# EAGLE design sensor (EAGLE 4.16)
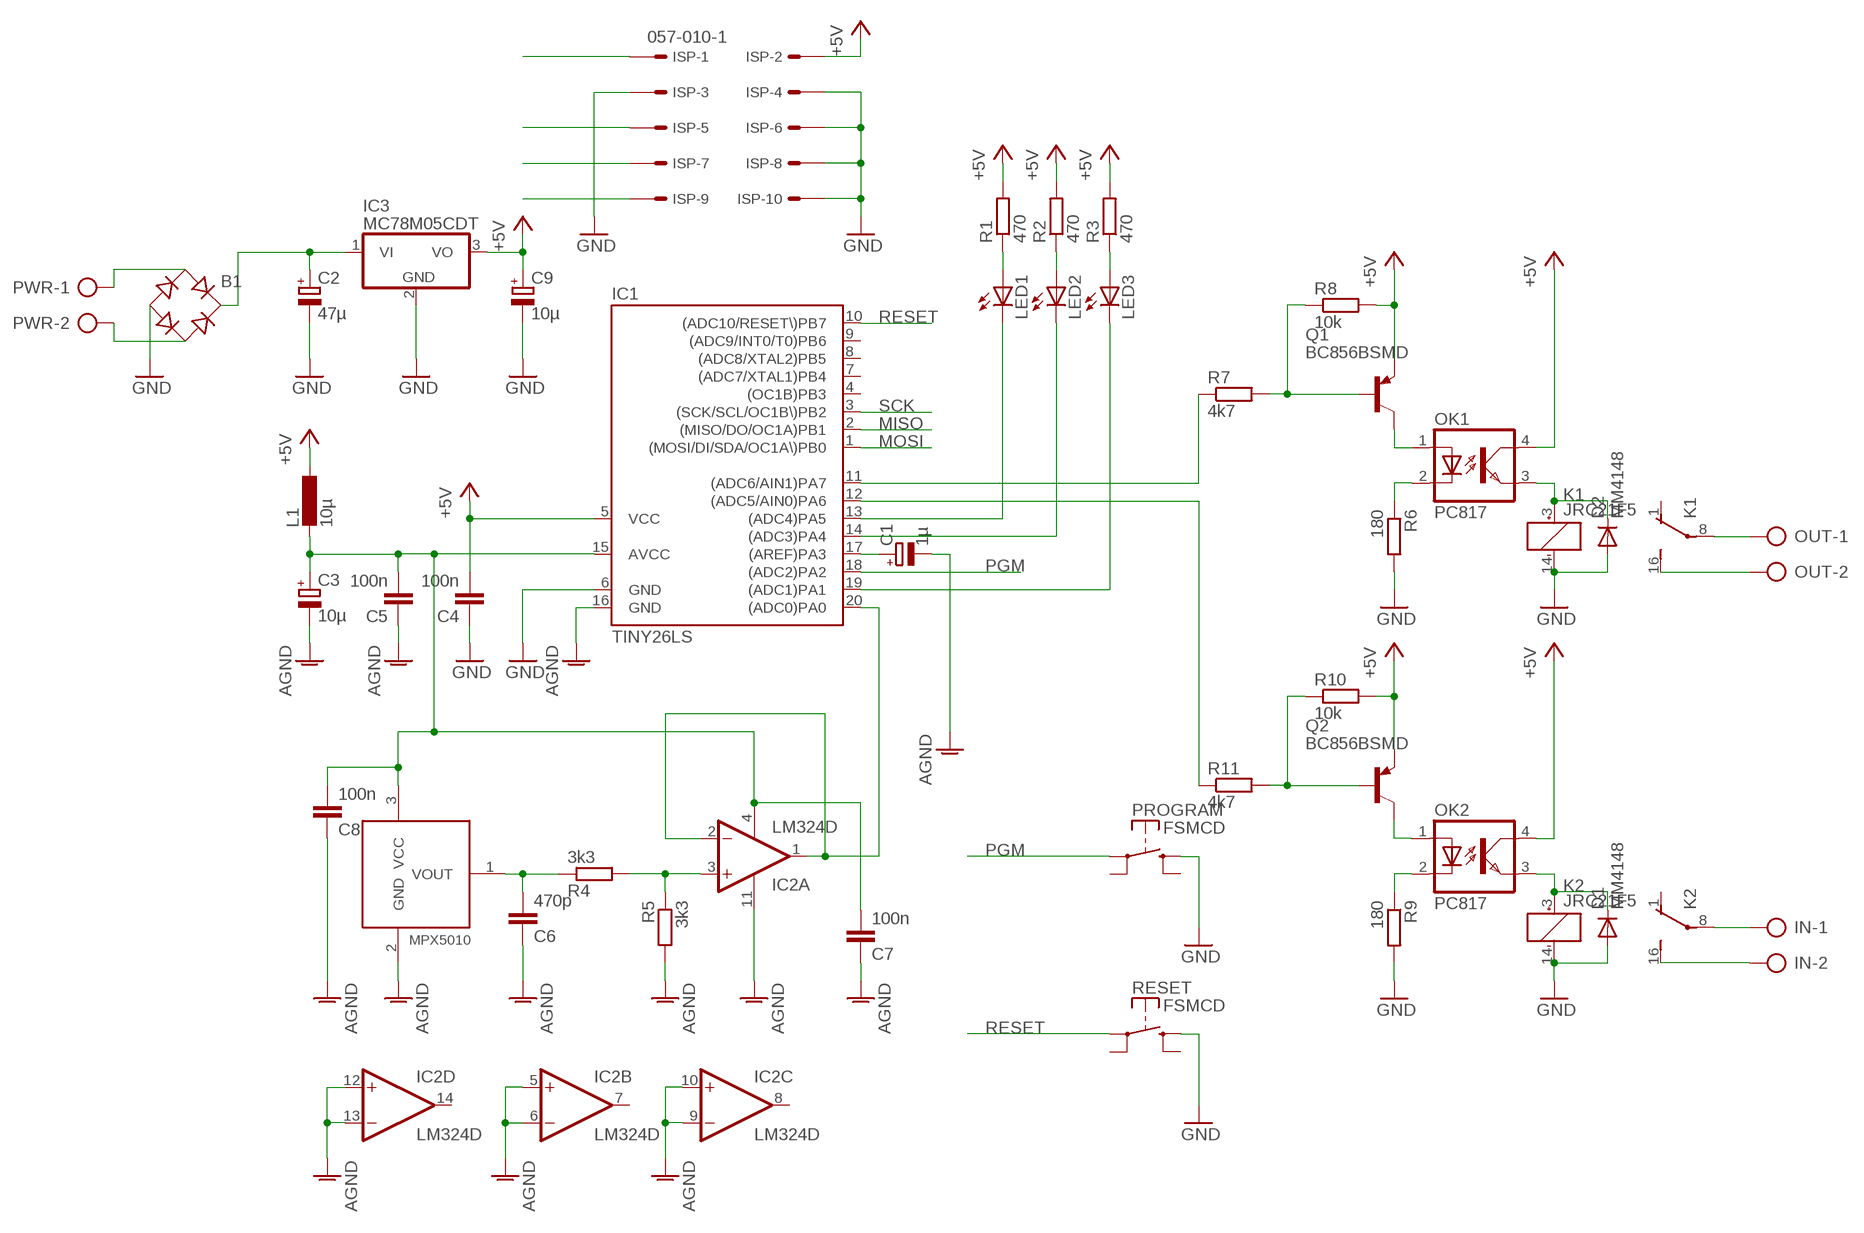
[diagram p0: schematic, sheet 1]

## Parts
B1  B-DIL  [SO04]
C1  1µ  CPOL-EUE2-5  [E2-5]
C2  47µ  CPOL-EUE3.5-8  [E3,5-8]
C3  10µ  CPOL-EUSMCC  [SMC_C]
C4  100n  C-EUC0805K  [C0805K]
C5  100n  C-EUC0805K  [C0805K]
C6  470p  C-EUC0805K  [C0805K]
C7  100n  C-EUC0805K  [C0805K]
C8  100n  C-EUC0805K  [C0805K]
C9  10µ  CPOL-EUE2-5  [E2-5]
D1  MM4148  DIODE-MINIMELF  [MINIMELF]
D2  MM4148  DIODE-MINIMELF  [MINIMELF]
IC1  TINY26LS  [SO20L]
IC2  LM324D  [SO14]
IC3  MC78M05CDT  78  [DPACK]
IN  AK500/2  [AK500/2]
ISP  057-010-1  [057-010-1]
K1  JRC21F5  [JRC21F]
K2  JRC21F5  [JRC21F]
L1  10µ  L-EU0204/7  [0204/7]
LED1  LED3MM  [LED3MM]
LED2  LED3MM  [LED3MM]
LED3  LED3MM  [LED3MM]
OK1  PC817  [DIL04]
OK2  PC817  [DIL04]
OUT  AK500/2  [AK500/2]
PROGRAM  FSMCD  [FSMCD]
PWR  AK500/2  [AK500/2]
Q1  BC856BSMD  [SOT23-BEC]
Q2  BC856BSMD  [SOT23-BEC]
R1  470  R-EU_R0805  [R0805]
R2  470  R-EU_R0805  [R0805]
R3  470  R-EU_R0805  [R0805]
R4  3k3  R-EU_R0805  [R0805]
R5  3k3  R-EU_R0805  [R0805]
R6  180  R-EU_R0805  [R0805]
R7  4k7  R-EU_R0805  [R0805]
R8  10k  R-EU_R0805  [R0805]
R9  180  R-EU_R0805  [R0805]
R10  10k  R-EU_R0805  [R0805]
R11  4k7  R-EU_R0805  [R0805]
RESET  FSMCD  [FSMCD]
U$2  MPX5010DP  [MPX5010DP]

## Nets
+5V: C4.2 C9.+ IC1.5(VCC) IC3.3(VO) ISP.2 L1.1 OK1.4(COL) OK2.4(COL) Q1.E Q2.E R1.2 R2.2 R3.2 R8.2 R10.2
AGND: C1.- C3.- C5.1 C6.1 C7.1 C8.1 IC1.16(GND) IC2.5(B:+IN) IC2.6(B:-IN) IC2.9(C:-IN) IC2.10(C:+IN) IC2.11(P:V-) IC2.12(D:+IN) IC2.13(D:-IN) R5.2 U$2.2(GND)
AVCC: C3.+ C5.2 C7.2 C8.2 IC1.15(AVCC) IC2.4(P:V+) L1.2 U$2.3(VCC)
GND: B1.2(-) C2.- C4.1 C9.- D1.A D2.A IC1.6(GND) IC3.2(GND) ISP.3 ISP.4 ISP.6 ISP.8 ISP.10 K1.14(-1:-) K2.14(-1:-) PROGRAM.P$3(S) R6.2 R9.2 RESET.P$3(S)
MISO: IC1.2((MISO/DO/OC1A)PB1) ISP.9
MOSI: IC1.1((MOSI/DI/SDA/OC1A\)PB0) ISP.1
N$1: C1.+ IC1.17((AREF)PA3)
N$2: IC2.3(A:+IN) R4.2 R5.1
N$3: B1.1(+) C2.+ IC3.1(VI)
N$4: LED1.A R1.1
N$5: LED2.A R2.1
N$6: LED3.A R3.1
N$7: IC1.19((ADC1)PA1) LED3.K(C)
N$8: IC1.13((ADC4)PA5) LED1.K(C)
N$9: IC1.14((ADC3)PA4) LED2.K(C)
N$10: IC1.20((ADC0)PA0) IC2.1(A:OUT) IC2.2(A:-IN)
N$11: OK1.1(A) Q1.C
N$12: OK1.2(C) R6.1
N$13: D2.C K1.3(-1:+) OK1.3(EMIT)
N$14: K1.8(-2:P) OUT.1
N$15: K1.16(-2:S) OUT.2
N$16: Q1.B R7.2 R8.1
N$17: D1.C K2.3(-1:+) OK2.3(EMIT)
N$18: IN.1 K2.8(-2:P)
N$19: IN.2 K2.16(-2:S)
N$20: OK2.1(A) Q2.C
N$21: OK2.2(C) R9.1
N$22: C6.2 R4.1 U$2.1(VOUT)
N$23: Q2.B R10.1 R11.2
N$24: IC1.11((ADC6/AIN1)PA7) R7.1
N$26: IC1.12((ADC5/AIN0)PA6) R11.1
N$27: B1.3(AC1) PWR.1
N$28: B1.4(AC2) PWR.2
PGM: IC1.18((ADC2)PA2) PROGRAM.P$1(P)
RESET: IC1.10((ADC10/RESET\)PB7) ISP.5 RESET.P$1(P)
SCK: IC1.3((SCK/SCL/OC1B\)PB2) ISP.7
Unconnected: IC1.4((OC1B)PB3) IC1.7((ADC7/XTAL1)PB4) IC1.8((ADC8/XTAL2)PB5) IC1.9((ADC9/INT0/T0)PB6) IC2.7(B:OUT) IC2.8(C:OUT) IC2.14(D:OUT) K1.1(-2:O) K2.1(-2:O) PROGRAM.P$2(P) PROGRAM.P$4(S) RESET.P$2(P) RESET.P$4(S) U$2.4 U$2.5 U$2.6

## Library data of the parts
B1 = mpx5010dp:B-DIL: RECTIFIER
C1-C3 C9 = rcl:CPOL-EU: POLARIZED CAPACITOR, European symbol
C4-C8 = rcl:C-EU: CAPACITOR, European symbol
D1 D2 = diode:DIODE-: DIODE
IC1 = mpx5010dp:TINY26*: 8-bit AVR Microcontroller with 2K Bytes Flash Source: http://www.atmel.com .. doc1477.pdf
IC2 = linear:LM324: OP AMP
IC3 = mpx5010dp:78*: Positive VOLTAGE REGULATOR Source: http://cache.national.com/ds/LM/LM78L05.pdf http://www.fairchildsemi.com/ds/LM/LM7805.pdf
IN OUT PWR = mpx5010dp:AK500/2: CONNECTOR
ISP = con-panduit:057-010-: CONNECTOR 10-pin series 057 contact pc board low profile headers
K1 K2 = mpx5010dp:JRC21F: HIGHLY RELIABLE MINIATURE DIP RELAYS NAiS Source: www.mew-europe.com/ac/download/ datasheet/relay/dr_en.pdf
L1 = rcl:L-EU: INDUCTOR, European symbol
LED1-LED3 = led:LED: LED OSRAM: - CHIPLED LG R971, LG N971, LY N971, LG Q971, LY Q971, LO R971, LY R971 LH N974, LH R974 LS Q976, LO Q976, LY Q976 LO Q996 - Hyper CHIPLED LW Q18S LB Q993, LB Q99A, LB R99A - SideLED LS A670, LO A670, LY A670, LG A670, LP A670 LB A673, LV A673, LT A673, LW A673 LH A674 LY A675 LS A676, LA A676, LO A676, LY A676, LW A676 LS A679, LY A679, LG A679 - Hyper Micro SIDELED® LS Y876, LA Y876, LO Y876, LY Y876 LT Y87S - SmartLED LW L88C, LW L88S LB L89C, LB L89S, LG L890 LS L89K, LO L89K, LY L89K LS L896, LA L896, LO L896, LY L896 - TOPLED LS T670, LO T670, LY T670, LG T670, LP T670 LSG T670, LSP T670, LSY T670, LOP T670, LYG T670 LG T671, LOG T671, LSG T671 LB T673, LV T673, LT T673, LW T673 LH T674 LS T676, LA T676, LO T676, LY T676, LB T676, LH T676, LSB T676, LW T676 LB T67C, LV T67C, LT T67C, LS T67K, LO T67K, LY T67K, LW E67C LS E67B, LA E67B, LO E67B, LY E67B, LB E67C, LV E67C, LT E67C LW T67C LS T679, LY T679, LG T679 LS T770, LO T770, LY T770, LG T770, LP T770 LB T773, LV T773, LT T773, LW T773 LH T774 LS E675, LA E675, LY E675, LS T675 LS T776, LA T776, LO T776, LY T776, LB T776 LHGB T686 LT T68C, LB T68C - Hyper Mini TOPLED® LB M676 - Mini TOPLED Santana® LG M470 LS M47K, LO M47K, LY M47K Source: http://www.osram.convergy.de/
OK1 OK2 = optocoupler:PC817: SHARP OPTO COUPLER
PROGRAM RESET = mpx5010dp:FSMCD: TYCO SWITCH
Q1 Q2 = transistor-pnp:BC856*: PNP Transistror
R1-R11 = rcl:R-EU_: RESISTOR, European symbol
U$2 = mpx5010dp:MPX5010DP

## Board
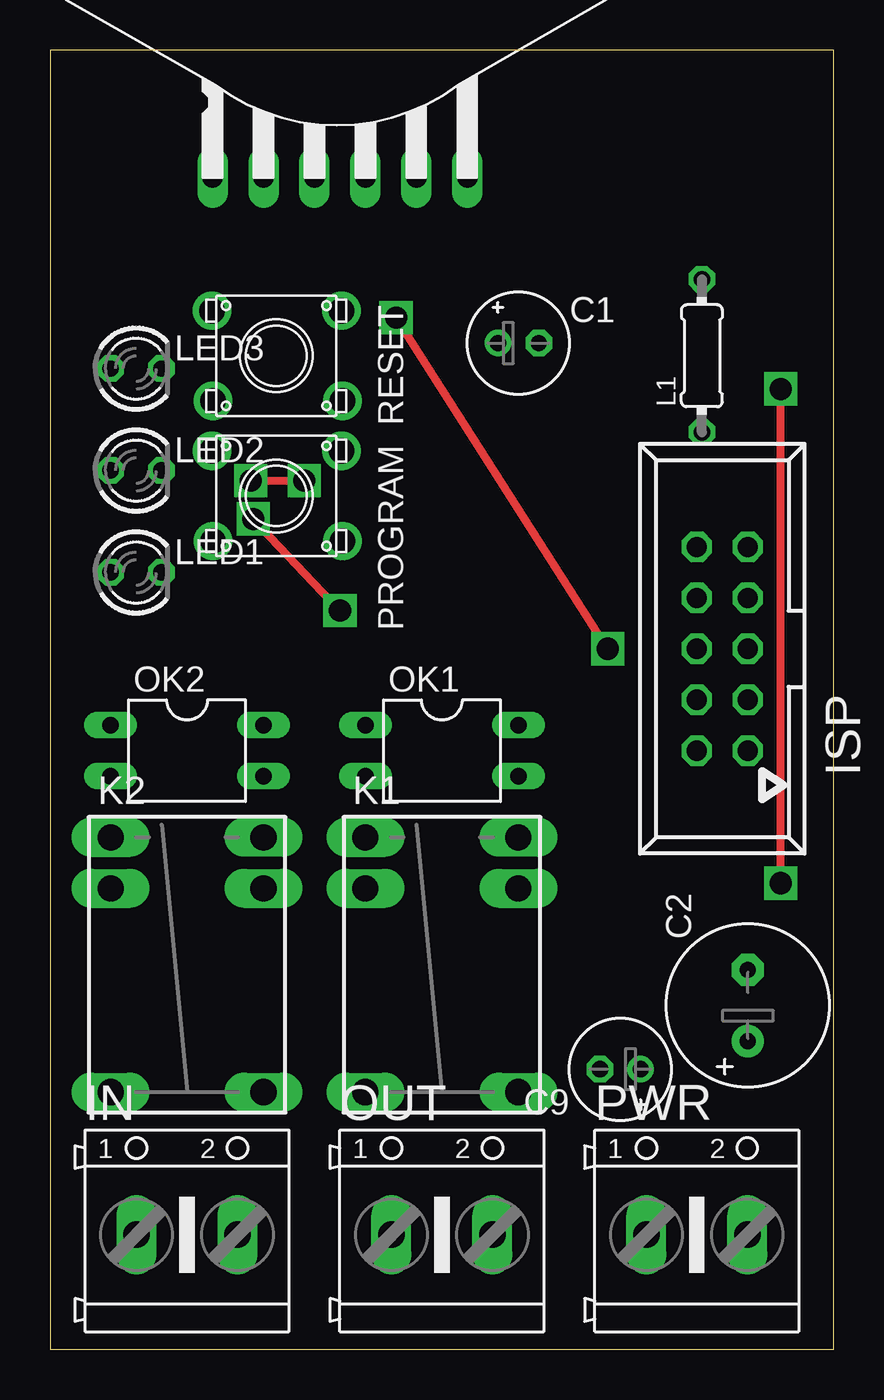
[diagram p1: board, top side]
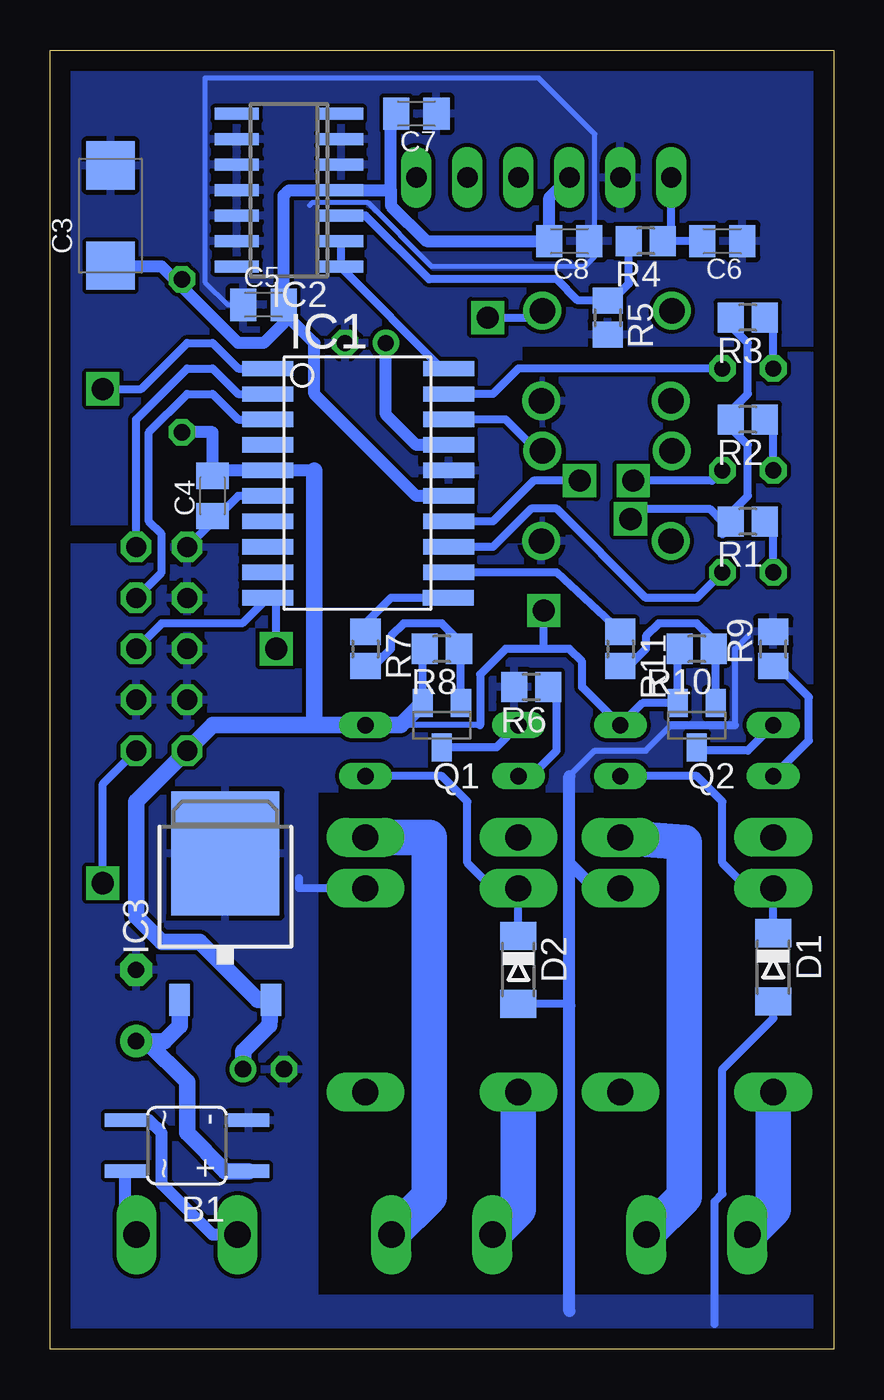
[diagram p2: board, bottom side, seen from below]

Size 39.04 x 64.76 mm. Coordinates in mm from the lower left corner, seen from the top.
Outline: 0,0 39.04,0 39.04,64.76 0,64.76 0,0
Copper layers (1*16): Top 0.035mm / dielectric 1.5mm / Bottom 0.035mm
Design rules "default": minimum track width 10mil, minimum drill 24mil, track to track 8mil, track to pad 8mil, pad to pad 8mil, via to via 8mil, smd to smd 8mil, copper to edge 40mil, drill to drill 8mil, minimum pad ring 10mil, minimum via ring 8mil, stop-mask expansion 4mil, vias tented up to drill 0mil, thermal gap 10mil

### Footprints (pad centres in the part's own frame; a part is rotated, then mirrored left to right if it is on the bottom)
SO04 = smd 0.66 x 2.032: 1 -1.905,-3.073; 2 0.635,-3.073; 3 0.635,3.073; 4 -1.905,3.073
E2-5 = drill 0.813 pad 1.27 round: + -1.016,0 | drill 0.813 pad 1.27 octagon: - 1.016,0
E3,5-8 = drill 0.813 pad 1.6 round: + -1.778,0 | drill 0.813 pad 1.6 octagon: - 1.778,0
SMC_C = smd 2.4 x 2.4: + -2.5,0; - 2.5,0
C0805K = smd 1.3 x 1.6: 1 -1,0; 2 1,0
MINIMELF = smd 1.4 x 1.8: A 1.7,0; C -1.7,0
SO20L = smd 0.762 x 2.54: 1 -5.08,-4.877; 2 -3.81,-4.877; 3 -2.54,-4.877; 4 -1.27,-4.877; 5 0,-4.877; 6 1.27,-4.877; 7 2.54,-4.877; 8 3.81,-4.877; 9 5.08,-4.877; 10 6.35,-4.877; 11 6.35,4.115; 12 5.08,4.14; 13 3.81,4.14; 14 2.54,4.14; 15 1.27,4.14; 16 0,4.14; 17 -1.27,4.14; 18 -2.54,4.14; 19 -3.81,4.14; 20 -5.08,4.14
SO14 = smd 0.6 x 2.2: 1 -3.81,-2.6; 2 -2.54,-2.6; 3 -1.27,-2.6; 4 0,-2.6; 5 1.27,-2.6; 6 2.54,-2.6; 7 3.81,-2.6; 8 3.81,2.6; 9 2.54,2.6; 10 1.27,2.6; 11 0,2.6; 12 -1.27,2.6; 13 -2.54,2.6; 14 -3.81,2.6
DPACK = smd 1 x 1.6: 1 -2.28,-4.8; 3 2.28,-4.8 | smd 5.4 x 6.2: 2 0,2.5
AK500/2 = drill 1.321 long: 1 -2.515,0; 2 2.515,0
057-010-1 = drill 1 octagon: 1 -5.08,-1.27; 2 -5.08,1.27; 3 -2.54,-1.27; 4 -2.54,1.27; 5 0,-1.27; 6 0,1.27; 7 2.54,-1.27; 8 2.54,1.27; 9 5.08,-1.27; 10 5.08,1.27
JRC21F = drill 1.3 long: 1 -6.35,-3.81; 3 -3.81,-3.81; 8 6.35,-3.81; 9 6.35,3.81; 14 -3.81,3.81; 16 -6.35,3.81
0204/7 = drill 0.813 octagon: 1 -3.81,0; 2 3.81,0
LED3MM = drill 0.813 octagon: A -1.27,0; K 1.27,0
DIL04 = drill 0.813 long: 1 -1.27,-3.81; 2 1.27,-3.81; 3 1.27,3.81; 4 -1.27,3.81
FSMCD = drill 1.27 round: P$1 -2.25,3.25; P$2 -2.25,-3.2; P$3 2.25,3.3; P$4 2.25,-3.15
SOT23-BEC = smd 1 x 1.4: B -0.95,-1.1; C 0,1.1; E 0.95,-1.1
R0805 = smd 1.3 x 1.5: 1 -0.85,0; 2 0.85,0
MPX5010DP = drill 1.016 long: 1 -6.35,-11.43; 2 -3.81,-11.43; 3 -1.27,-11.43; 4 1.27,-11.43; 5 3.81,-11.43; 6 6.35,-11.43

### Placement (x,y rotation side)
B1  32.22,10.79 90 bottom
C1  23.33,50.16 0 top
C2  34.76,17.14 90 top
C3  36.03,56.51 90 bottom
C4  30.95,42.54 90 bottom
C5  28.41,52.07 0 bottom
C6  5.55,55.24 180 bottom
C7  20.79,61.59 180 bottom
C8  13.17,55.24 180 bottom
C9  28.41,13.97 180 top
D1  [MINIMELF]  3.01,19.04 270 bottom
D2  [MINIMELF]  15.71,18.92 270 bottom
IC1  23.33,43.81 270 bottom
IC2  27.14,57.78 90 bottom
IC3  78  [DPACK]  30.31,22.22 0 bottom
IN  6.82,5.71 0 top
ISP  33.49,34.92 90 top
K1  19.52,19.17 270 top
K2  6.82,19.17 270 top
L1  32.47,49.53 90 top
LED1  4.28,38.73 0 top
LED2  4.28,43.81 0 top
LED3  4.28,48.89 0 top
OK1  19.52,29.84 270 top
OK2  6.82,29.84 270 top
OUT  19.52,5.71 0 top
PROGRAM  11.27,42.54 270 top
PWR  32.22,5.71 0 top
Q1  19.52,31.11 180 bottom
Q2  6.82,31.11 180 bottom
R1  4.28,41.27 180 bottom
R2  4.28,46.35 180 bottom
R3  4.28,51.43 180 bottom
R4  9.36,55.24 180 bottom
R5  11.27,51.43 270 bottom
R6  15.08,33.02 180 bottom
R7  23.33,34.92 270 bottom
R8  19.52,34.92 180 bottom
R9  3.01,34.92 90 bottom
R10  6.82,34.92 180 bottom
R11  10.63,34.92 270 bottom
RESET  11.27,49.53 270 top
U$2  14.44,69.84 0 top

### Tracks (layer width: path | path; a pad name or v marks a point on that pad's centre or on a via)
+5V  (via drill 1.1)
  Top 0.406: v14.44,36.83 v10.12,41.4
  Bottom 0.305: 17.61,31.11 OK1.4
  Bottom 0.406: 7.46,34.92 R10.2 7.77,34.92 Q2.E 9.53,32.21 OK2.4 12.54,33.02 12.54,34.29 13.17,34.92 14.44,34.92 | 20.47,34.92 R8.2 | Q1.E 20.47,34.92 | 20.47,34.92 20.79,34.92 | 14.44,34.92 16.34,34.92 17.61,33.65 17.61,31.11 | 30.95,43.81 C4.2 | R3.2 5.13,51.01 4.28,50.16 4.28,47.62 5.55,46.35 R2.2 5.13,45.93 4.28,45.08 4.28,42.54 5.55,41.27 | 5.55,41.27 5.55,40.64 | 5.55,41.27 R1.2 | 5.55,41.27 6.18,41.91 9.36,41.91 v10.12,41.4 | 14.44,34.92 v14.44,36.83
  Bottom 0.61: 25.87,43.81 IC1.5 30.95,43.81 30.95,45.72 L1.1
  Bottom 0.813: C9.+ 29.43,14.85 28.13,16.15 IC3.3 28.69,17.42 31.58,20.31 33.49,20.31 34.76,21.58 34.76,27.3 ISP.2 30.95,31.11 25.87,31.11 | 25.87,31.11 OK1.4 21.57,31.11 Q1.E | 25.87,31.11 25.87,43.81
AGND
  Bottom 0.254: C5.1 30.19,52.07 31.33,53.21 31.33,63.37 14.69,63.37 11.9,60.57 11.9,54.48 12.41,53.97 20.03,53.97 23.2,57.15 26,57.15 26.12,57.02
  Bottom 0.406: C5.1 29.68,52.07
  pour Bottom: 38.57,64.13 0.47,64.13 0.47,50.16 15.71,50.16 15.71,41.27 38.57,41.27
AVCC
  Bottom 0.406: C7.2 21.42,61.59 22.06,60.96 | 27.14,51.43 27.14,52.07 C5.2 27.41,51.16 | 36.03,53.97 C3.+ | 32.22,52.7 L1.2
  Bottom 0.61: C5.2 27.41,57.51 27.14,57.78 IC2.4 22.06,57.78 | 22.06,57.78 22.06,57.02 20.28,55.24 C8.2 14.17,57.41 U$2.3 | 22.06,57.78 22.06,60.96 | IC1.15 20.79,42.54 25.87,47.62 25.87,50.16 27.14,51.43 | 27.41,51.16 28.41,50.16 29.68,50.16 32.22,52.7 33.49,53.97 36.03,53.97
GND
  Bottom 0.305: 8.09,31.11 9.36,29.84 11.9,29.84 13.17,28.57 | 4.92,31.11 4.92,34.92 4.28,35.55 | 30.95,41.27 C4.1
  Bottom 0.406: 29.68,23.49 30.95,24.76 | 8.09,31.11 4.92,31.11 | IC1.6 29.68,42.54 30.95,41.27 ISP.10 | D2.A 13.09,17.22 13.17,17.14 | D1.A 3.01,16.5 5.55,13.97 5.55,7.74 5.93,7.36 5.93,1.27 | K1.14 26.63,22.98 26.63,23.49
  Bottom 0.61: K2.14 11.9,22.98 13.17,24.25 | 13.17,24.25 13.17,28.57 | 13.17,1.9 13.17,17.14 13.17,24.25
  pour Bottom: 0.47,27.93 25.87,27.93 25.87,2.54 0.47,2.54 0.47,0.63 38.57,0.63 38.57,40 34.76,40 14.44,40 14.44,49.53 0.47,49.53
MISO
  Bottom 0.406: ISP.9 34.76,46.35 32.22,48.89 30.95,48.89 29.68,47.62 IC1.2
MOSI  (via drill 1.1)
  Top 0.406: v36.41,23.24 v36.41,47.87
  Bottom 0.406: IC1.1 29.68,48.89 30.95,50.16 32.22,50.16 34.51,47.87 v36.41,47.87 | ISP.1 36.41,28.19 v36.41,23.24
N$1
  Bottom 0.61: C1.+ 22.31,46.6 20.79,45.08 IC1.17
N$2
  Bottom 0.406: R4.2 10.21,53.12 11.27,52.07 R5.1 12.75,52.28 13.81,53.34 20.15,53.34 23.33,56.51 IC2.3 24.6,56.51
N$3
  Bottom 0.813: B1.1 30.31,8.89 32.22,10.79 32.22,13.33 34.25,15.36 | 34.25,15.36 C2.+ | IC3.1 32.59,16.13 33.36,15.36 34.25,15.36
N$4
  Bottom 0.406: R1.1 3.01,41.27 LED1.A
N$5
  Bottom 0.406: R2.1 3.01,46.35 LED2.A
N$6
  Bottom 0.406: R3.1 3.01,51.43 LED3.A
N$7
  Bottom 0.406: LED3.K 15.71,48.89 16.98,47.62 IC1.19 19.52,47.62
N$8
  Bottom 0.406: IC1.13 16.98,40 15.08,41.91 13.81,41.91 9.36,37.46 6.82,37.46 LED1.K
N$9  (via drill 1.1)
  Top 0.406: v10,43.3 v12.66,43.3
  Bottom 0.406: IC1.14 16.98,41.27 14.95,43.3 v12.66,43.3 12.54,43.3 | LED2.K 6.06,43.3 v10,43.3
N$10
  Bottom 0.406: IC1.20 19.52,48.89 24.54,53.91 IC2.1 24.54,55.18 24.6,55.24 IC2.2
N$11
  Bottom 0.406: Q1.C 16.81,30.01 OK1.1
N$12
  Bottom 0.406: R6.1 13.81,33.02 13.81,29.84 15.08,28.57 OK1.2
N$13
  Bottom 0.406: OK1.3 19.52,28.57 18.25,27.3 18.25,24.25 16.98,22.98 K1.3 D2.C
N$14
  Bottom 1.778: OUT.1 16.98,5.71 15.71,6.98 K1.8
N$15
  Bottom 1.778: K1.16 20.15,25.52 20.15,7.62 22.06,5.71 OUT.2
N$16
  Bottom 0.406: 18.57,34.92 R8.1 18.67,35.34 19.52,36.19 21.42,36.19 22.06,35.55 22.06,34.92 23.33,33.65 R7.2 | Q1.B 18.57,34.92 | 18.57,34.92 18.25,34.92
N$17
  Bottom 0.406: OK2.3 6.82,28.57 5.55,27.3 5.55,24.25 4.28,22.98 K2.3 D1.C
N$18
  Bottom 1.778: IN.1 4.28,5.71 3.01,6.98 K2.8
N$19
  Bottom 1.778: K2.16 7.46,25.27 7.46,7.62 9.36,5.71 IN.2
N$20
  Bottom 0.406: Q2.C 6.82,29.84 4.28,29.84 OK2.1
N$21
  Bottom 0.406: OK2.2 1.23,30.35 1.23,32.51 3.01,34.29 R9.1
N$22
  Bottom 0.406: U$2.1 8.09,55.88 8.73,55.24 R4.1 C6.2
N$23
  Bottom 0.406: Q2.B 5.87,34.92 R10.1 6.18,34.92 6.18,35.55 6.82,36.19 8.73,36.19 9.36,35.55 9.36,34.92 10.63,33.65 R11.2
N$24
  Bottom 0.406: IC1.11 22.06,37.46 23.33,36.19 R7.1
N$26
  Bottom 0.406: R11.1 11.05,36.19 13.81,38.73 IC1.12 19.52,38.73
N$27
  Bottom 0.61: PWR.1 30.95,5.71 33.49,8.25 33.49,10.79 34.12,11.43 B1.3
N$28
  Bottom 0.61: PWR.2 34.76,5.71 35.29,6.24 B1.4
PGM
  Bottom 0.406: 14.52,44.52 14.44,44.45 | PROGRAM.P$1 14.52,44.52 | IC1.18 16.34,46.35 14.52,44.52
RESET  (via drill 1.1)
  Top 0.406: v27.77,34.92 v17.23,51.43
  Bottom 0.406: IC1.10 29.48,36.19 33.49,36.19 ISP.5 | IC1.10 28.41,37.46 | IC1.10 27.77,37.46 v27.77,34.92 | RESET.P$1 14.52,51.51 14.44,51.43 v17.23,51.43
SCK
  Bottom 0.406: IC1.3 29.68,46.35 30.95,47.62 32.22,47.62 34.12,45.72 34.12,41.27 33.49,40.64 33.49,38.73 ISP.7